# Altium schematic sheet Accelerometers.SchDoc
size A4; SheetNumber: 1; SheetTotal: 1
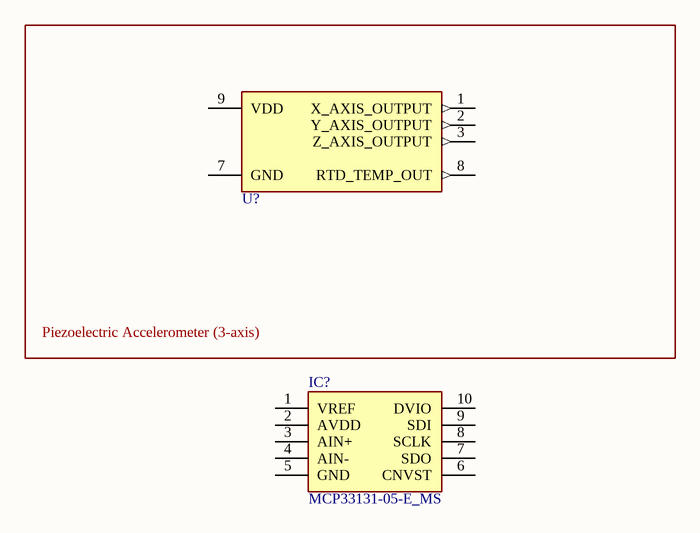
[diagram p0: Accelerometers.SchDoc]

## Parts
IC?  MCP33131-05-E_MS  [SOP50P490X110-10N]
U?  Piezoelectric Accelerometer  [[IMU] 830M1-1000]  (value not drawn)

## Blocks framed on the sheet
Piezoelectric Accelerometer (3-axis): U?

## Nets

Not connected (* = marked no-connect by the designer): IC? 1(VREF) 2(AVDD) 3(AIN+) 4(AIN-) 5(GND) 6(CNVST) 7(SDO) 8(SCLK) 9(SDI) 10(DVIO); U? 1(X_AXIS_OUTPUT) 2(Y_AXIS_OUTPUT) 3(Z_AXIS_OUTPUT) 7(GND) 8(RTD_TEMP_OUT) 9(VDD)

## Library data of the parts
IC? = MCP33131-05-E_MS: Integrated Circuit; Manufacturer_Name: Microchip; Manufacturer_Part_Number: MCP33131-05-E/MS; Datasheet Link: http://ww1.microchip.com/downloads/en/DeviceDoc/MCP33131-MCP33121-MCP33111-Family-Data-Sheet-DS20006122A.pdf; Height: 1.1mm; Mouser Part Number: 579-MCP33131-05-E/MS; Mouser Price/Stock: https://www.mouser.co.uk/ProductDetail/Microchip-Technology/MCP33131-05-E-MS?qs=byeeYqUIh0MFz3TMaJesaA%3D%3D; Arrow Part Number: MCP33131-05-E/MS; Arrow Price/Stock: https://www.arrow.com/en/products/mcp33131-05-ems/microchip-technology?utm_currency=USD&region=nac
U? = [IMU] 830M1-1000: 830M1-1000; Supplier 1: DigiKey; Supplier Part Number 1: 223-830M1-1000CT-ND